# Altium project Main_V1.PrjPcb
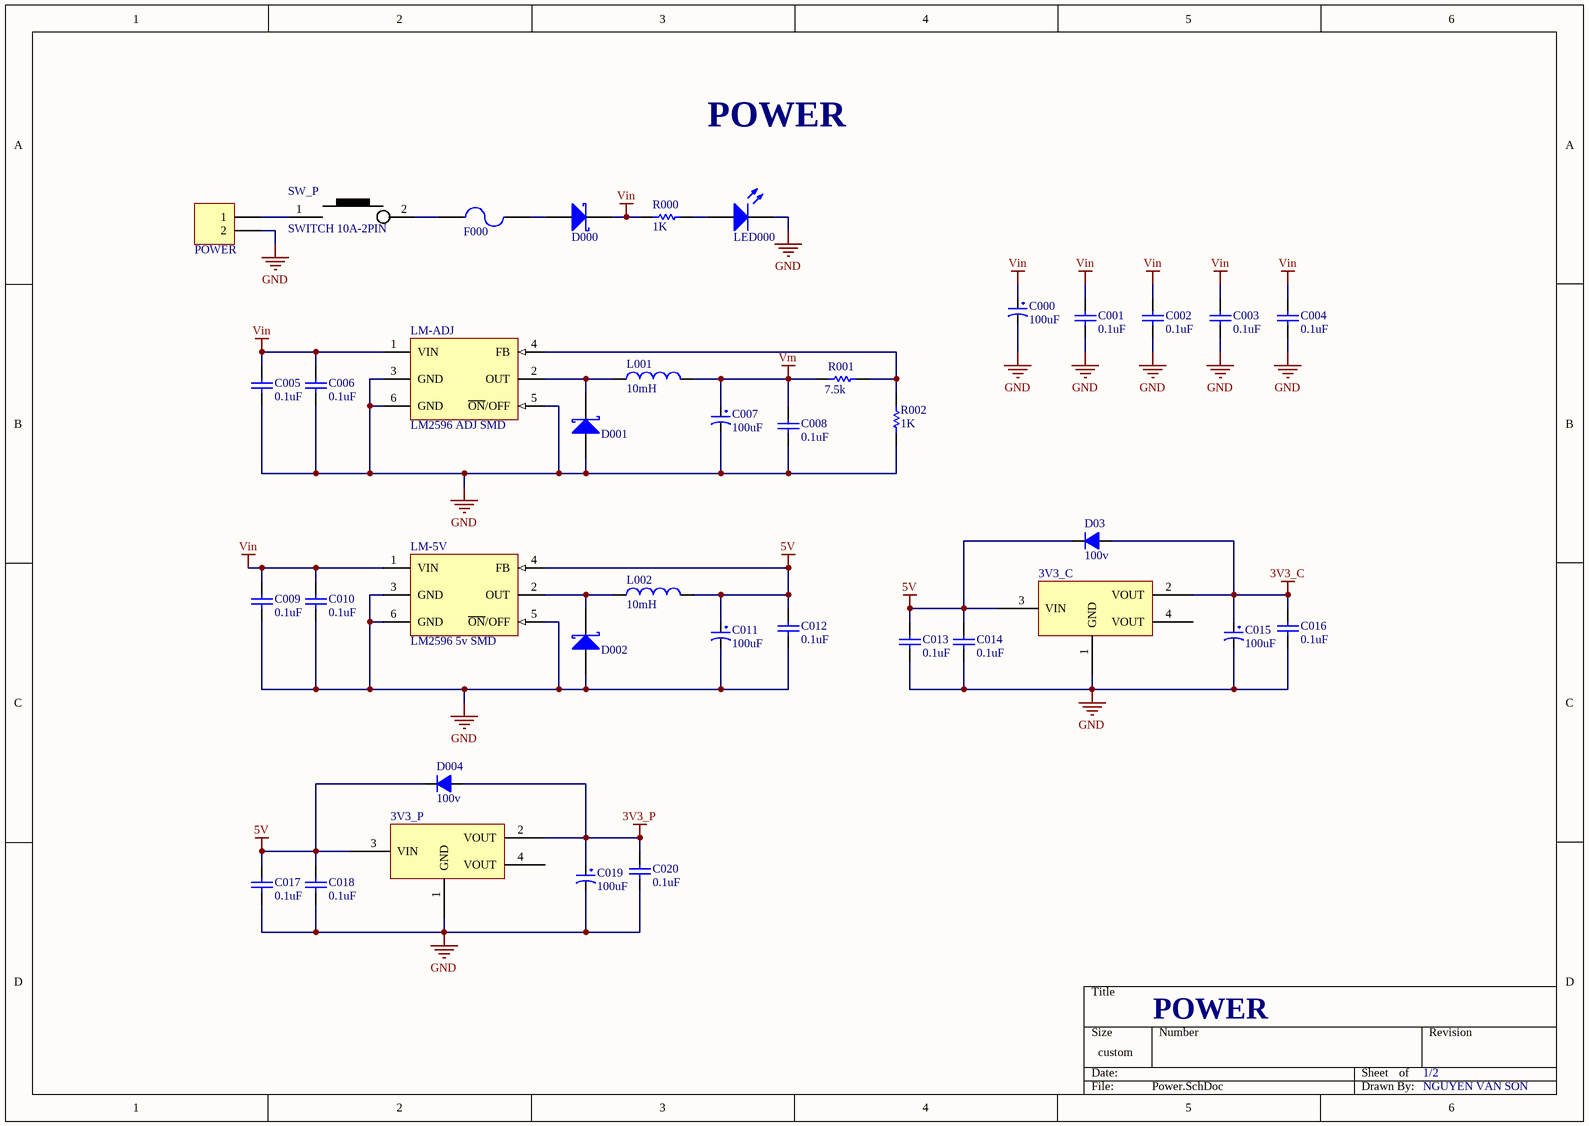
[diagram p0: Power.SchDoc]
2 sheets, 112 parts. Net scope: global (net labels, ports and power ports of the same name join across sheets).
Board file: Main_V1_Pcb.PcbDoc
Sheets:
  Power.SchDoc
  Control.SchDoc

## Sheet Power.SchDoc: POWER
size 297 x 209 mm; SheetNumber: 1; SheetTotal: 2

### Parts
3V3_C  AMS1117-3.3V  [SOT223]  (value not drawn)
3V3_P  AMS1117-3.3V  [SOT223]  (value not drawn)
C000  100uF  [tu tantalum smd7343]
C001  value 0.1uF  [CAP-SM-0603]  (hidden comment: Cap Non-Pol SMD)
C002  value 0.1uF  [CAP-SM-0603]  (hidden comment: Cap Non-Pol SMD)
C003  value 0.1uF  [CAP-SM-0603]  (hidden comment: Cap Non-Pol SMD)
C004  value 0.1uF  [CAP-SM-0603]  (hidden comment: Cap Non-Pol SMD)
C005  value 0.1uF  [CAP-SM-0603]  (hidden comment: Cap Non-Pol SMD)
C006  value 0.1uF  [CAP-SM-0603]  (hidden comment: Cap Non-Pol SMD)
C007  100uF  [tu tantalum smd3528]
C008  value 0.1uF  [CAP-SM-0603]  (hidden comment: Cap Non-Pol SMD)
C009  value 0.1uF  [CAP-SM-0603]  (hidden comment: Cap Non-Pol SMD)
C010  value 0.1uF  [CAP-SM-0603]  (hidden comment: Cap Non-Pol SMD)
C011  100uF  [tu tantalum smd3528]
C012  value 0.1uF  [CAP-SM-0603]  (hidden comment: Cap Non-Pol SMD)
C013  value 0.1uF  [CAP-SM-0603]  (hidden comment: Cap Non-Pol SMD)
C014  value 0.1uF  [CAP-SM-0603]  (hidden comment: Cap Non-Pol SMD)
C015  100uF  [tu tantalum smd3528]
C016  value 0.1uF  [CAP-SM-0603]  (hidden comment: Cap Non-Pol SMD)
C017  value 0.1uF  [CAP-SM-0603]  (hidden comment: Cap Non-Pol SMD)
C018  value 0.1uF  [CAP-SM-0603]  (hidden comment: Cap Non-Pol SMD)
C019  100uF  [tu tantalum smd3528]
C020  value 0.1uF  [CAP-SM-0603]  (hidden comment: Cap Non-Pol SMD)
D000  D Schottky  [SS34]  (value not drawn)
D001  D Schottky  [SS34]  (value not drawn)
D002  D Schottky  [SS34]  (value not drawn)
D03  100v  [DIODE SMA]
D004  100v  [DIODE SMA]
F000  Fuse  [FUSE SMD]  (value not drawn)
L001  value 10mH  [INDUCTOR 12.5x12.5]  (hidden comment: Inductor)
L002  value 10mH  [INDUCTOR 12.5x12.5]  (hidden comment: Inductor)
LED000  LED SMD  [LED_0805_Blue]  (value not drawn)
LM-5V  LM2596 5v SMD  [TO263-5]
LM-ADJ  LM2596 ADJ SMD  [TO263-5]
POWER  Domino 2  [DOMINO SMALL 2]  (value not drawn)
R000  value 1K  [RES-SM-0603]  (hidden comment: RESISTOR SMD)
R001  value 7.5k  [RES-SM-0603]  (hidden comment: RESISTOR SMD)
R002  value 1K  [RES-SM-0603]  (hidden comment: RESISTOR SMD)
SW_P  SWITCH 10A-2PIN  [SW_2ARS_TH]

### Nets
3V3_C: 3V3_C.2(VOUT) C015.1 C016.2 D03.1(A)
3V3_P: 3V3_P.2(VOUT) C019.1 C020.2 D004.1(A)
5V: 3V3_C.3(VIN) 3V3_P.3(VIN) C011.1 C012.2 C013.2 C014.2 C017.2 C018.2 D03.2(K) D004.2(K) L002.2 LM-5V.4(FB)
GND: 3V3_C.1(GND) 3V3_P.1(GND) C000.2 C001.1 C002.1 C003.1 C004.1 C005.1 C006.1 C007.2 C008.1 C009.1 C010.1 C011.2 C012.1 C013.1 C014.1 C015.2 C016.1 C017.1 C018.1 C019.2 C020.1 D001.1(A) D002.1(A) LED000.2(K) LM-5V.3(GND) LM-5V.5(~{ON}/OFF) LM-5V.6(GND) LM-ADJ.3(GND) LM-ADJ.5(~{ON}/OFF) LM-ADJ.6(GND) POWER.2 R002.2
Vin: C000.1 C001.2 C002.2 C003.2 C004.2 C005.2 C006.2 C009.2 C010.2 D000.2(K) LM-5V.1(VIN) LM-ADJ.1(VIN) R000.1
Vm: C007.1 C008.2 L001.2 R001.2
NetD000_1: D000.1(A) F000.2
NetD001_2: D001.2(K) L001.1 LM-ADJ.2(OUT)
NetD002_2: D002.2(K) L002.1 LM-5V.2(OUT)
NetF000_1: F000.1 SW_P.2
NetLED000_1: LED000.1(A) R000.2
NetLM-ADJ_4: LM-ADJ.4(FB) R001.1 R002.1
NetPOWER_1: POWER.1 SW_P.1

Not connected (* = marked no-connect by the designer): 3V3_C 4(VOUT); 3V3_P 4(VOUT)

### Notes on the sheet
- POWER
- 1/2
- NGUYEN VAN SON

### Library data of the parts
3V3_C 3V3_P = AMS1117 SMD: Dán; Value: AMS1117-3.3V SOT223; Don_Vi: Con; Ma_Hang: MH000596; Ghi_Chu: *; Kieu_Chan: *; Chung_Loai: Dán
C000 C007 = Tu tantalum 100uF 50V SMD7343: Dán; Don_Vi: Con; So_Chan: 2; Ten_Linh_Kien: Tụ tantalum 107T-100uF 50V SMD7343; Ma_Hang: MH008401; Chung_Loai: Dán; Kieu_Chan: *
C001 C002 C003 C004 C005 C006 C008 C009 C010 C012 C013 C014 C016 C017 C018 C020 = Cap Non-Pol SMD: Capacitor
C011 = Tu tantalum 100uF 10V SMD6032: Dán; Don_Vi: Con; So_Chan: 2; Ten_Linh_Kien: Tụ tantalum 107A-100uF 10V SMD6032; Ma_Hang: MH007594; Chung_Loai: Dán; Kieu_Chan: *
C015 C019 = Tu tantalum 100uF 6.3V SMD3528: Dán; Don_Vi: Con; So_Chan: 2; Ten_Linh_Kien: Tụ tantalum 107J-100uF 6.3V SMD3528; Ma_Hang: MH007595; Chung_Loai: Dán; Kieu_Chan: *
D000 D001 D002 = D Schottky: Schottky Diode; Published: 8-Jun-2000; LatestRevisionDate: 17-Jul-2002; LatestRevisionNote: Re-released for DXP Platform.; PackageReference: SMB; Publisher: Altium Limited; PackageDescription: DO-214-AA/SMB; 2 C-Bend Leads; Body 5.3 x 3.6 mm, inc. leads (LxW); Code_JEDEC: DO-214-AA
D03 D004 = Diode 1N4007: Cắm; Ten_Linh_Kien: Diode 1N4007 1A (DIP); Don_Vi: Con; Ma_Hang: MH001063; Ghi Chu: *; Kieu_Chan: *; Chung_Loai: Cắm
LED000 = LED SMD: LED
LM-5V LM-ADJ = LM2576 3.3V SMD: Dán; Don_Vi: Con; Ma_Hang: MH001260; Ten_Linh_Kien: LM2576S-3.3V BUCK 3.3V 3A TO263-5; Ghi_Chu: *; Kieu_Chan: *; Chung_Loai: Dán
POWER = Domino 2: Domino, 2-Pin; LatestRevisionDate: 17-Jul-2002; LatestRevisionNote: Re-released for DXP Platform.; Publisher: Altium Limited
R000 R001 R002 = RESISTOR SMD: Resistor
SW_P = SW1_RS-471005264153-TH: Rocker Switch SPST 16A (AC), 10A (DC) 250V Panel Mount, Snap-In; Manufacturer: Würth Elektronik; Alternate Part Number-1: NA; Manufacturer Part Number: 471005264153; Case/Package: TH; Supplier-1: Würth Elektronik; Supplier Part Number-1: 471005264153

## Sheet Control.SchDoc
size 297 x 209 mm; ENG_APP_DATE: --/--/--; DSN_APP_DATE: --/--/--; CHK_APP_DATE: --/--/--; SheetNumber: 2; SheetTotal: 2
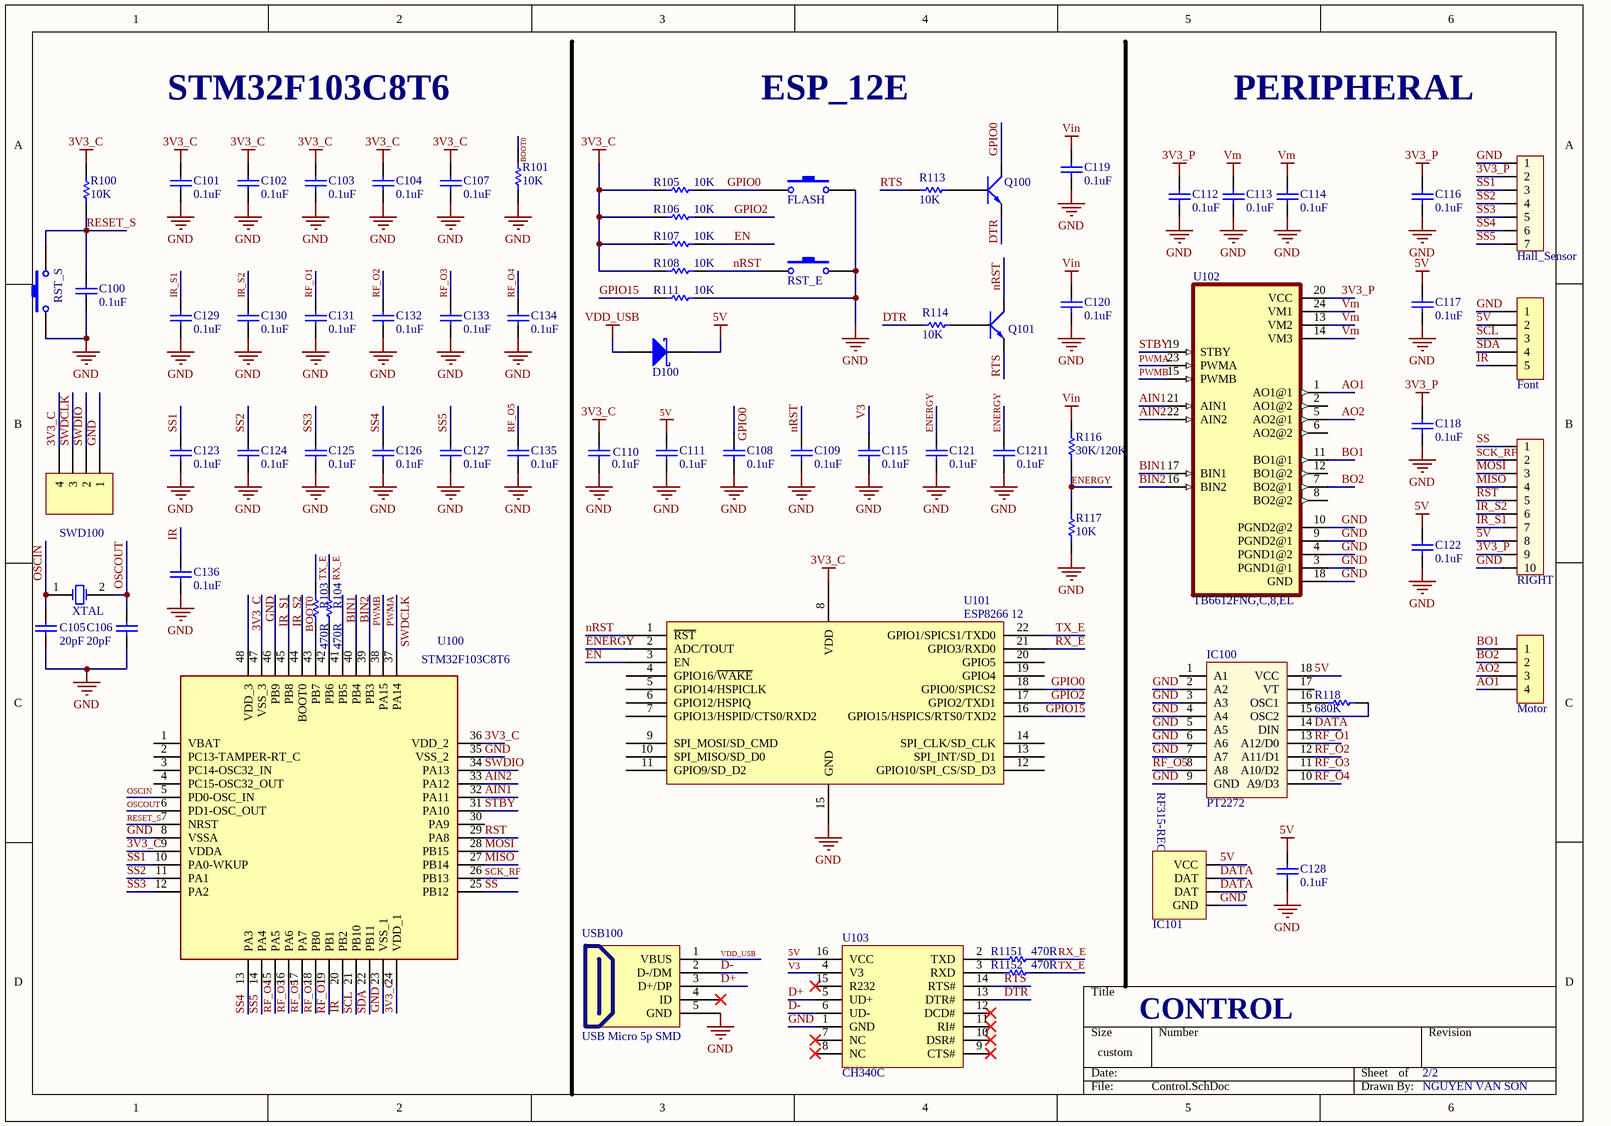
[diagram p1: Control.SchDoc]

### Parts
C100  value 0.1uF  [CAP-SM-0603]  (hidden comment: Cap Non-Pol SMD)
C101  value 0.1uF  [CAP-SM-0603]  (hidden comment: Cap Non-Pol SMD)
C102  value 0.1uF  [CAP-SM-0603]  (hidden comment: Cap Non-Pol SMD)
C103  value 0.1uF  [CAP-SM-0603]  (hidden comment: Cap Non-Pol SMD)
C104  value 0.1uF  [CAP-SM-0603]  (hidden comment: Cap Non-Pol SMD)
C105  value 20pF  [CAP-SM-0603]  (hidden comment: Cap Non-Pol SMD)
C106  value 20pF  [CAP-SM-0603]  (hidden comment: Cap Non-Pol SMD)
C107  value 0.1uF  [CAP-SM-0603]  (hidden comment: Cap Non-Pol SMD)
C108  value 0.1uF  [CAP-SM-0603]  (hidden comment: Cap Non-Pol SMD)
C109  value 0.1uF  [CAP-SM-0603]  (hidden comment: Cap Non-Pol SMD)
C110  value 0.1uF  [CAP-SM-0603]  (hidden comment: Cap Non-Pol SMD)
C111  value 0.1uF  [CAP-SM-0603]  (hidden comment: Cap Non-Pol SMD)
C112  value 0.1uF  [CAP-SM-0603]  (hidden comment: Cap Non-Pol SMD)
C113  value 0.1uF  [CAP-SM-0603]  (hidden comment: Cap Non-Pol SMD)
C114  value 0.1uF  [CAP-SM-0603]  (hidden comment: Cap Non-Pol SMD)
C115  value 0.1uF  [CAP-SM-0603]  (hidden comment: Cap Non-Pol SMD)
C116  value 0.1uF  [CAP-SM-0603]  (hidden comment: Cap Non-Pol SMD)
C117  value 0.1uF  [CAP-SM-0603]  (hidden comment: Cap Non-Pol SMD)
C118  value 0.1uF  [CAP-SM-0603]  (hidden comment: Cap Non-Pol SMD)
C119  value 0.1uF  [CAP-SM-0603]  (hidden comment: Cap Non-Pol SMD)
C120  value 0.1uF  [CAP-SM-0603]  (hidden comment: Cap Non-Pol SMD)
C121  value 0.1uF  [CAP-SM-0603]  (hidden comment: Cap Non-Pol SMD)
C122  value 0.1uF  [CAP-SM-0603]  (hidden comment: Cap Non-Pol SMD)
C123  value 0.1uF  [CAP-SM-0603]  (hidden comment: Cap Non-Pol SMD)
C124  value 0.1uF  [CAP-SM-0603]  (hidden comment: Cap Non-Pol SMD)
C125  value 0.1uF  [CAP-SM-0603]  (hidden comment: Cap Non-Pol SMD)
C126  value 0.1uF  [CAP-SM-0603]  (hidden comment: Cap Non-Pol SMD)
C127  value 0.1uF  [CAP-SM-0603]  (hidden comment: Cap Non-Pol SMD)
C128  value 0.1uF  [CAP-SM-0603]  (hidden comment: Cap Non-Pol SMD)
C129  value 0.1uF  [CAP-SM-0603]  (hidden comment: Cap Non-Pol SMD)
C130  value 0.1uF  [CAP-SM-0603]  (hidden comment: Cap Non-Pol SMD)
C131  value 0.1uF  [CAP-SM-0603]  (hidden comment: Cap Non-Pol SMD)
C132  value 0.1uF  [CAP-SM-0603]  (hidden comment: Cap Non-Pol SMD)
C133  value 0.1uF  [CAP-SM-0603]  (hidden comment: Cap Non-Pol SMD)
C134  value 0.1uF  [CAP-SM-0603]  (hidden comment: Cap Non-Pol SMD)
C135  value 0.1uF  [CAP-SM-0603]  (hidden comment: Cap Non-Pol SMD)
C136  value 0.1uF  [CAP-SM-0603]  (hidden comment: Cap Non-Pol SMD)
C1211  value 0.1uF  [CAP-SM-0603]  (hidden comment: Cap Non-Pol SMD)
D100  D Schottky  [SS34]  (value not drawn)
FLASH  Tact SW - 2Pin  [SW-SMD]  (value not drawn)
H100  Hall_Sensor  [Header 7P DC 2.54]
H101  Font  [Header 5P DC 2.54]
H102  RIGHT  [XH2.54M-10]
H104  Motor  [JP 1x4 DT]
IC100  PT2272  [DIP18]
IC101  RF315-RECEIVE-NOIC  [RF315-RECEIVE-NOIC]  (value not drawn)
Q100  HF  [SOT23]  (value not drawn)
Q101  HF  [SOT23]  (value not drawn)
R100  value 10K  [RES-SM-0603]  (hidden comment: RESISTOR SMD)
R101  value 10K  [RES-SM-0603]  (hidden comment: RESISTOR SMD)
R103  value 470R  [RES-SM-0603]  (hidden comment: RESISTOR SMD)
R104  value 470R  [RES-SM-0603]  (hidden comment: RESISTOR SMD)
R105  value 10K  [RES-SM-0603]  (hidden comment: RESISTOR SMD)
R106  value 10K  [RES-SM-0603]  (hidden comment: RESISTOR SMD)
R107  value 10K  [RES-SM-0603]  (hidden comment: RESISTOR SMD)
R108  value 10K  [RES-SM-0603]  (hidden comment: RESISTOR SMD)
R111  value 10K  [RES-SM-0603]  (hidden comment: RESISTOR SMD)
R113  value 10K  [RES-SM-0603]  (hidden comment: RESISTOR SMD)
R114  value 10K  [RES-SM-0603]  (hidden comment: RESISTOR SMD)
R116  value 30K/120K  [RES-SM-0603]  (hidden comment: RESISTOR SMD)
R117  value 10K  [RES-SM-0603]  (hidden comment: RESISTOR SMD)
R118  value 680K  [RES-SM-0603]  (hidden comment: RESISTOR SMD)
R1151  value 470R  [RES-SM-0603]  (hidden comment: RESISTOR SMD)
R1152  value 470R  [RES-SM-0603]  (hidden comment: RESISTOR SMD)
RST_E  Tact SW - 2Pin  [SW-SMD]  (value not drawn)
RST_S  Tact SW - 2Pin  [SW-SMD]  (value not drawn)
SWD100  Header 4H  [JP4]  (value not drawn)
U100  STM32F103C8T6  [LQFP-48_19.6_393_58X11_SMD]
U101  ESP8266 12  [ESP8266 12]
U102  TB6612FNG,C,8,EL  [SOP65P760X160-24N]
U103  CH340C  [SOIC16_50_284_25X90_SMT]
USB100  USB Micro 5p SMD  [USB Micro 5p SMD]
XTAL  XTAL  [XT2]  (value not drawn)

### Nets
3V3_C: C101.2 C102.2 C103.2 C104.2 C107.2 C110.2 R100.2 R105.2 R106.2 R107.2 R108.2 SWD100.4 U100.9(VDDA) U100.24(VDD_1) U100.36(VDD_2) U100.48(VDD_3) U101.8(VDD)
3V3_P: C112.2 C116.2 C118.2 H100.2 H102.9 U102.20(VCC)
5V: C111.2 C117.2 C122.2 C128.2 D100.2(K) H101.2 H102.8 IC100.18(VCC) IC101.1(VCC) U103.16(VCC)
GND: C100.1 C101.1 C102.1 C103.1 C104.1 C105.1 C106.1 C107.1 C108.1 C109.1 C110.1 C111.1 C112.1 C113.1 C114.1 C115.1 C116.1 C117.1 C118.1 C119.1 C120.1 C121.1 C122.1 C123.1 C124.1 C125.1 C126.1 C127.1 C128.1 C129.1 C130.1 C131.1 C132.1 C133.1 C134.1 C135.1 C136.1 C1211.1 FLASH.1 H100.1 H101.1 H102.10 IC100.2(A2) IC100.3(A3) IC100.4(A4) IC100.5(A5) IC100.6(A6) IC100.7(A7) IC100.9(GND) IC101.4(GND) R101.2 R111.1 R117.1 RST_E.1 RST_S.1 SWD100.1 U100.8(VSSA) U100.23(VSS_1) U100.35(VSS_2) U100.47(VSS_3) U101.15(GND) U102.3(PGND1@1) U102.4(PGND1@2) U102.9(PGND2@1) U102.10(PGND2@2) U102.18(GND) U103.1(GND) USB100.5(GND)
VDD_USB: D100.1(A) USB100.1(VBUS)
Vin: C119.2 C120.2 R116.2
Vm: C113.2 C114.2 U102.13(VM2) U102.14(VM3) U102.24(VM1)
AIN1: U100.32(PA11) U102.21(AIN1)
AIN2: U100.33(PA12) U102.22(AIN2)
AO1: H104.4 U102.1(AO1@1)
AO2: H104.3 U102.5(AO2@1)
BIN1: U100.41(PB5) U102.17(BIN1)
BIN2: U100.40(PB4) U102.16(BIN2)
BO1: H104.1 U102.11(BO1@1)
BO2: H104.2 U102.7(BO2@1)
BOOT0: R101.1 U100.44(BOOT0)
D+: U103.5(UD+) USB100.3(D+/DP)
D-: U103.6(UD-) USB100.2(D-/DM)
DATA: IC100.14(DIN) IC101.2(DAT) IC101.3(DAT)
DTR: Q100.2(E) R114.1 U103.13(DTR#)
EN: R107.1 U101.3(EN)
ENERGY: C121.2 C1211.2 R116.1 R117.2 U101.2(ADC/TOUT)
GPIO0: C108.2 FLASH.2 Q100.3(C) R105.1 U101.18(GPIO0/SPICS2)
GPIO2: R106.1 U101.17(GPIO2/TXD1)
GPIO15: R111.2 U101.16(GPIO15/HSPICS/RTS0/TXD2)
IR: C136.2 H101.5 U100.20(PB2)
IR_S1: C129.2 H102.7 U100.46(PB9)
IR_S2: C130.2 H102.6 U100.45(PB8)
MISO: H102.4 U100.27(PB14)
MOSI: H102.3 U100.28(PB15)
nRST: C109.2 Q101.3(C) R108.1 RST_E.2 U101.1(~{RST})
OSCIN: C105.2 U100.5(PD0-OSC_IN) XTAL.1(OSC1)
OSCOUT: C106.2 U100.6(PD1-OSC_OUT) XTAL.2(OSC2)
PWMA: U100.38(PA15) U102.23(PWMA)
PWMB: U100.39(PB3) U102.15(PWMB)
RESET_S: C100.2 R100.1 RST_S.2 U100.7(NRST)
RF_O1: C131.2 IC100.13(A12/D0) U100.19(PB1)
RF_O2: C132.2 IC100.12(A11/D1) U100.18(PB0)
RF_O3: C133.2 IC100.11(A10/D2) U100.16(PA6)
RF_O4: C134.2 IC100.10(A9/D3) U100.15(PA5)
RF_O5: C135.2 IC100.8(A8) U100.17(PA7)
RST: H102.5 U100.29(PA8)
RTS: Q101.2(E) R113.1 U103.14(RTS#)
RX_E: R104.2 R1151.1 U101.21(GPIO3/RXD0)
SCK_RF: H102.2 U100.26(PB13)
SCL: H101.3 U100.21(PB10)
SDA: H101.4 U100.22(PB11)
SS: H102.1 U100.25(PB12)
SS1: C123.2 H100.3 U100.10(PA0-WKUP)
SS2: C124.2 H100.4 U100.11(PA1)
SS3: C125.2 H100.5 U100.12(PA2)
SS4: C126.2 H100.6 U100.13(PA3)
SS5: C127.2 H100.7 U100.14(PA4)
STBY: U100.31(PA10) U102.19(STBY)
SWDCLK: SWD100.3 U100.37(PA14)
SWDIO: SWD100.2 U100.34(PA13)
TX_E: R103.2 R1152.1 U101.22(GPIO1/SPICS1/TXD0)
V3: C115.2 U103.4(V3)
NetIC100_15: IC100.15(OSC2) R118.1
NetIC100_16: IC100.16(OSC1) R118.2
NetQ100_1: Q100.1(B) R113.2
NetQ101_1: Q101.1(B) R114.2
NetR103_1: R103.1 U100.43(PB7)
NetR104_1: R104.1 U100.42(PB6)
NetR1151_2: R1151.2 U103.2(TXD)
NetR1152_2: R1152.2 U103.3(RXD)

Not connected (* = marked no-connect by the designer): IC100 1(A1) 17(VT); U100 1(VBAT) 2(PC13-TAMPER-RT_C) 3(PC14-OSC32_IN) 4(PC15-OSC32_OUT) 30(PA9); U101 4(GPIO16/~{WAKE}) 5(GPIO14/HSPICLK) 6(GPIO12/HSPIQ) 7(GPIO13/HSPID/CTS0/RXD2) 9(SPI_MOSI/SD_CMD) 10(SPI_MISO/SD_D0) 11(GPIO9/SD_D2) 12(GPIO10/SPI_CS/SD_D3) 13(SPI_INT/SD_D1) 14(SPI_CLK/SD_CLK) 19(GPIO4) 20(GPIO5); U102 2(AO1@2) 6(AO2@2) 8(BO2@2) 12(BO1@2); U103 7(NC)* 8(NC)* 9(CTS#)* 10(DSR#)* 11(RI#)* 12(DCD#)* 15(R232)*; USB100 4(ID)*

### Notes on the sheet
- STM32F103C8T6
- ESP_12E
- PERIPHERAL
- CONTROL
- 2/2
- NGUYEN VAN SON
- (in symbol RF315-RECEIVE-NOIC) RF315-REC

### Library data of the parts
C100-C136 C1211 = Cap Non-Pol SMD: Capacitor
D100 = D Schottky: Schottky Diode; Published: 8-Jun-2000; LatestRevisionDate: 17-Jul-2002; LatestRevisionNote: Re-released for DXP Platform.; PackageReference: SMB; Publisher: Altium Limited; PackageDescription: DO-214-AA/SMB; 2 C-Bend Leads; Body 5.3 x 3.6 mm, inc. leads (LxW); Code_JEDEC: DO-214-AA
FLASH RST_E RST_S = Tact SW - 2Pin: Switch button 2 pin
H100 = Header 7P 2.54 Duc Cong: Cắm; Ten_Linh_Kien: Header 7P XH2.54-7P Đực Cong; Don_Vi: Con; Ma_Hang: MH004118; Chung_Loai: Cắm
H101 = Header 5P 2.54 Duc Cong: Cắm; Ten_Linh_Kien: Header 5P XH2.54-5P Đực Cong; Don_Vi: Con; Ma_Hang: MH001308; Chung_Loai: Cắm
H102 = Header 10P 2.54 Duc Thang: Cắm; Ten_Linh_Kien: Header 10P XH2.54-10P Đực Thẳng; Don_Vi: Con; Ma_Hang: MH001286; Chung_Loai: Cắm
H104 = Header 4P 2.54 Duc Cong: Cắm; Ten_Linh_Kien: Header 4P XH2.54-4P Đực Cong; Don_Vi: Con; Ma_Hang: MH001310; Chung_Loai: Cắm
IC100 = PT2272: Remote Control Decoder
IC101 = RF315-RECEIVE-NOIC: Manufacturer: W¨¹rth Elektronik eiSos GmbH; partNo: 613004143121; ComponentLink1 Description: Manufacturer; ComponentLink2 Description: Datasheet; NoPins: 04; Created Date: 29 March 2013; ComponentLink1URL: http://www.we-online.com; ComponentLink2URL: http://katalog.we-online.de/em/datasheet/6130xx143121.pdf; Created by: Karrer Zheng
Q100 Q101 = C1815 HF SMD: NPN transistor; Value: C9014
R100 R101 R103-R108 R111 R113 R114 R116-R118 R1151 R1152 = RESISTOR SMD: Resistor
SWD100 = Header 4H: Header, 4-Pin, Right Angle; LatestRevisionDate: 17-Jul-2002; LatestRevisionNote: Re-released for DXP Platform.; Publisher: Altium Limited
U100 = IC_STM32F103C8T6: ARM® Cortex®-M3 STM32F1 Microcontroller IC 32-Bit 72MHz 64KB (64K x 8) FLASH 48-LQFP (7x7) /; Manufacturer: STMicroelectronics; Alternate Part Number-1: NA; Manufacturer Part Number: STM32F103C8T6; Case/Package: LQFP48; Supplier-1: LCSC; Supplier Part Number-1: STM32F103C8T6
U101 = ESP8266 12: ESP8266 12 22 Pin; IC: ESP8266-EX; Vendor: Ai-thinker
U102 = TB6612FNG,C,8,EL: - Motor Driver Power MOSFET Parallel 24-SSOP; MF: Toshiba; SnapEDA_Link: https://www.snapeda.com/parts/TB6612FNG,C,8,EL/Toshiba+Semiconductor+and+Storage/view-part/?ref=snap; Package: SSOP-24 Toshiba; MP: TB6612FNG,C,8,EL; Check_prices: https://www.snapeda.com/parts/TB6612FNG,C,8,EL/Toshiba+Semiconductor+and+Storage/view-part/?ref=eda; Purchase-URL: https://pricing.snapeda.com/search/part/TB6612FNG,C,8,EL/?ref=eda; Price: None; Value: *; Availability: In Stock
U103 = IC_CH340C: USB Bridge, USB to UART USB 2.0 UART Interface; Manufacturer: Olimex; Alternate Part Number-1: NA; Manufacturer Part Number: CH340C; Case/Package: SOIC16; Supplier-1: LCSC; Supplier Part Number-1: C84681
USB100 = USB Micro 5p SMD: USB Type B; Ten: MicroUSB MK5P SMD; Ma_Hang: MH001020
XTAL = XTAL: Crystal Oscillator; Published: 8-Jun-2000; LatestRevisionDate: 17-Jul-2002; LatestRevisionNote: Re-released for DXP Platform.; PackageReference: R38; Publisher: Altium Limited; PackageDescription: Crystal, Thru-Hole; 2 Leads; Body 3.1 x 8.2 mm (Dia.xH)

## Nets that join several sheets
3V3_C: Power (3V3_C.2 C015.1 C016.2 D03.1), Control (17 pins)
3V3_P: Power (3V3_P.2 C019.1 C020.2 D004.1), Control (6 pins)
5V: Power (12 pins), Control (10 pins)
GND: Power (34 pins), Control (68 pins)
Vin: Power (13 pins), Control (C119.2 C120.2 R116.2)
Vm: Power (C007.1 C008.2 L001.2 R001.2), Control (5 pins)